# Altium schematic sheet PDB_schem.SchDoc
size D; SheetNumber: 1; SheetTotal: 1; SPICEModelCacheNIXBEUAC: <root> / <DocumentId>NIXBEUAC</DocumentId> / </root>
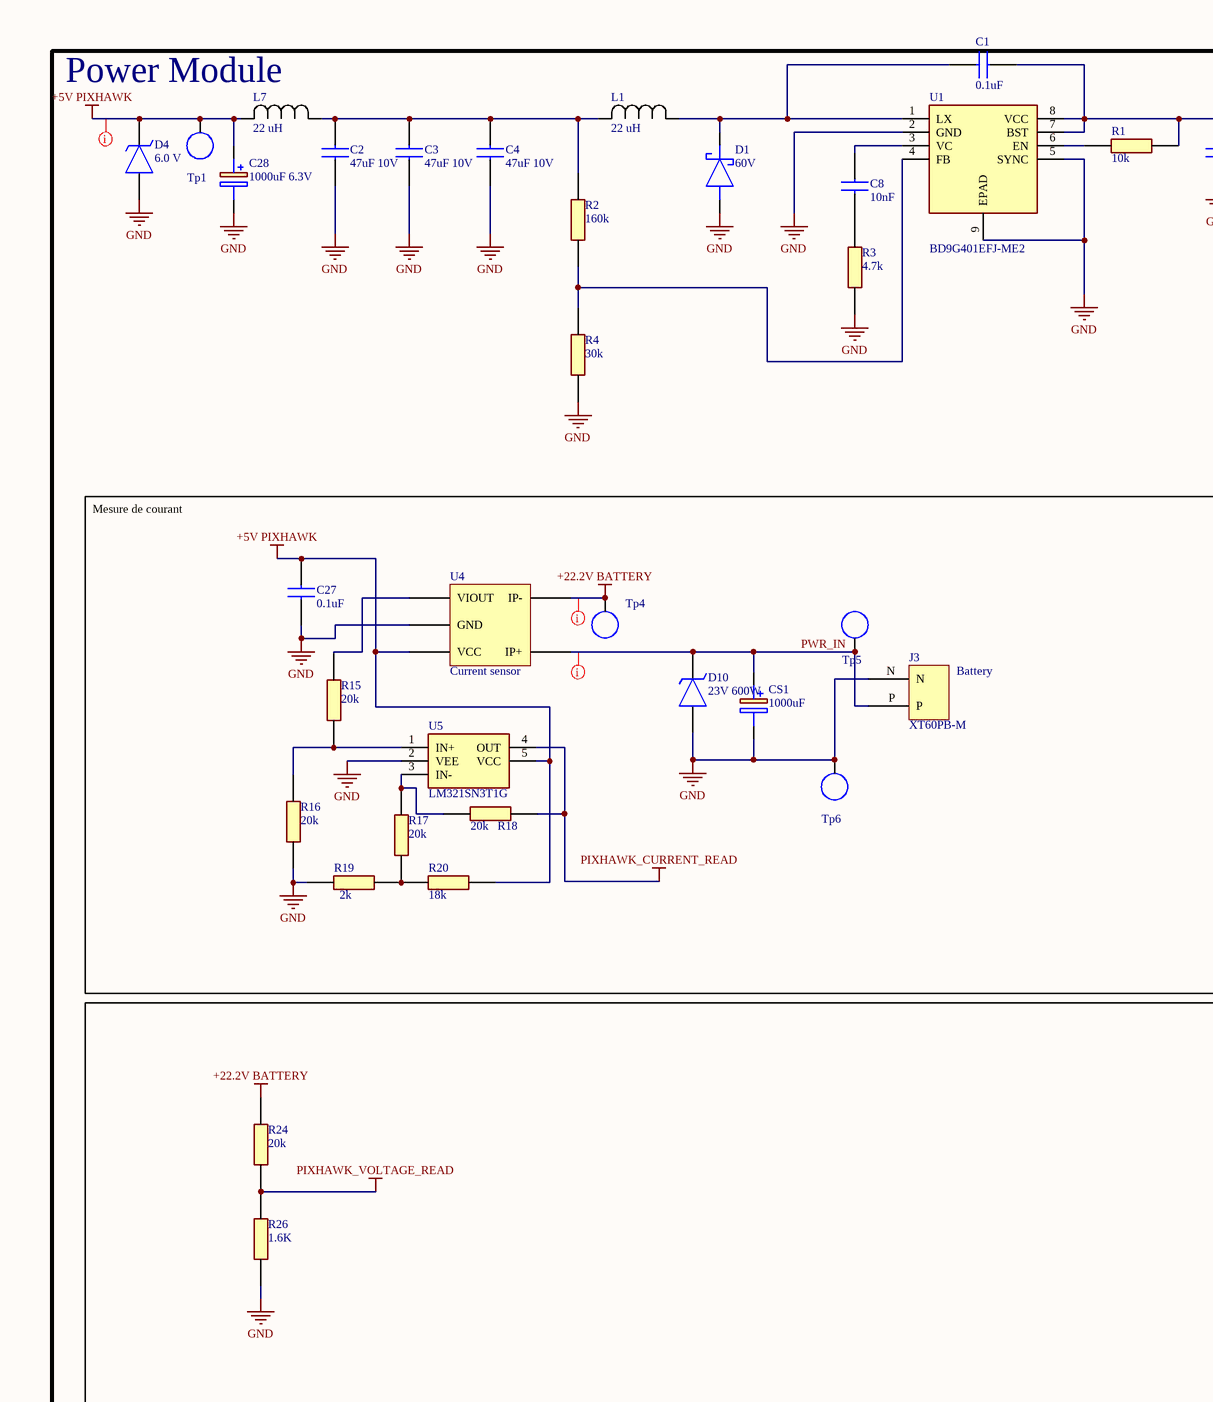
[diagram p0: PDB_schem.SchDoc, left]
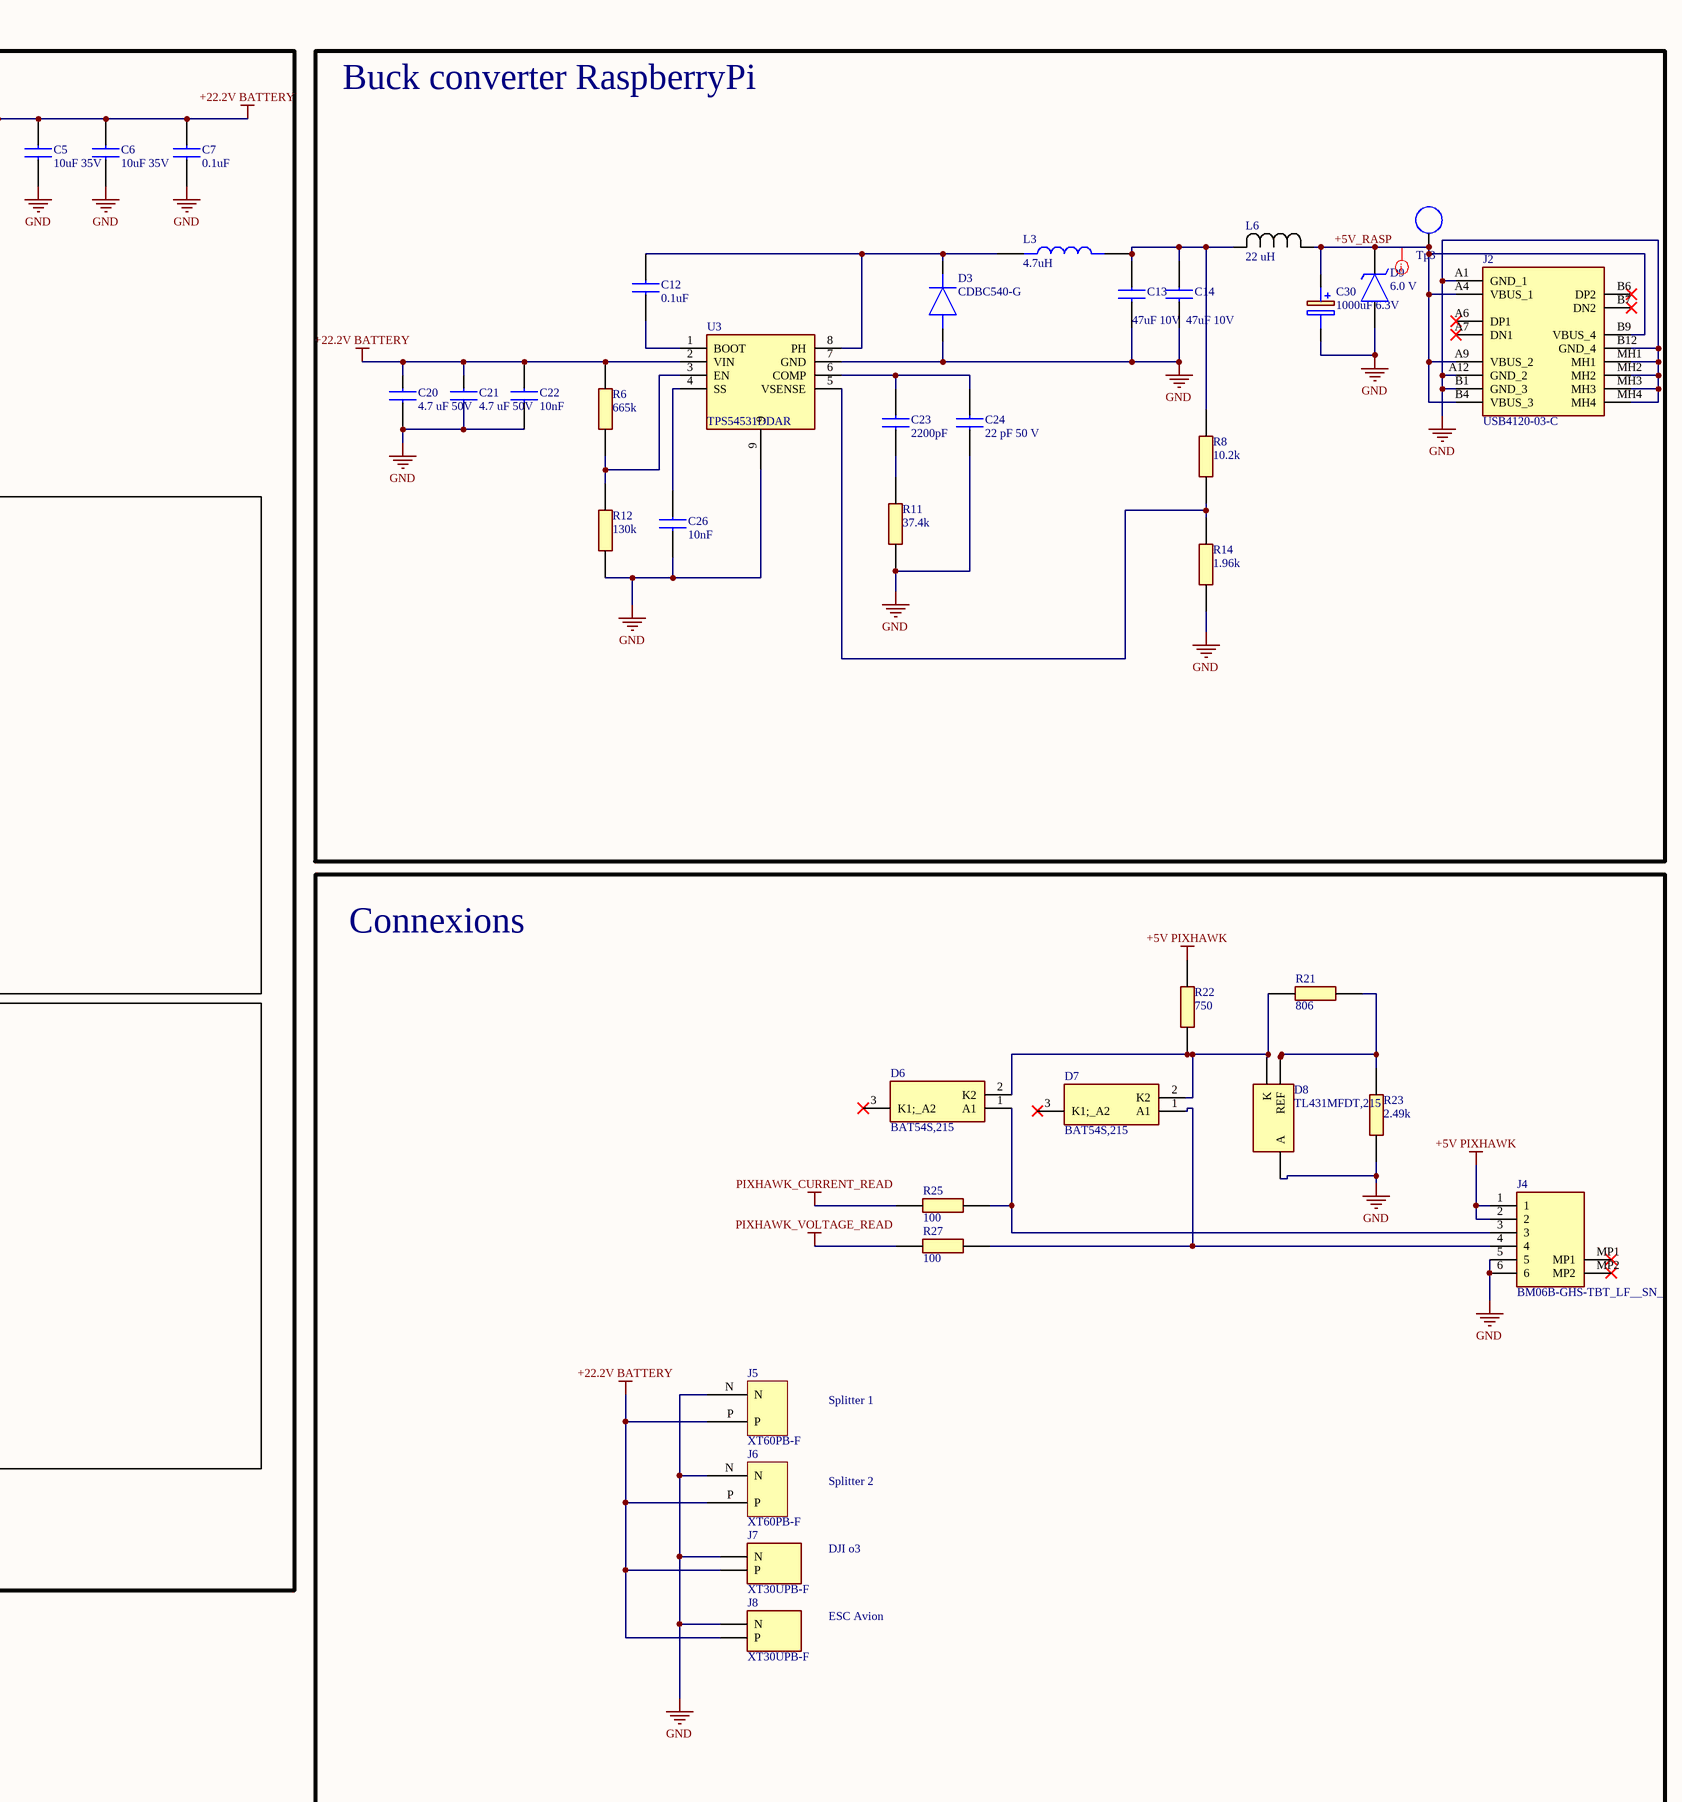
[diagram p1: PDB_schem.SchDoc, middle]
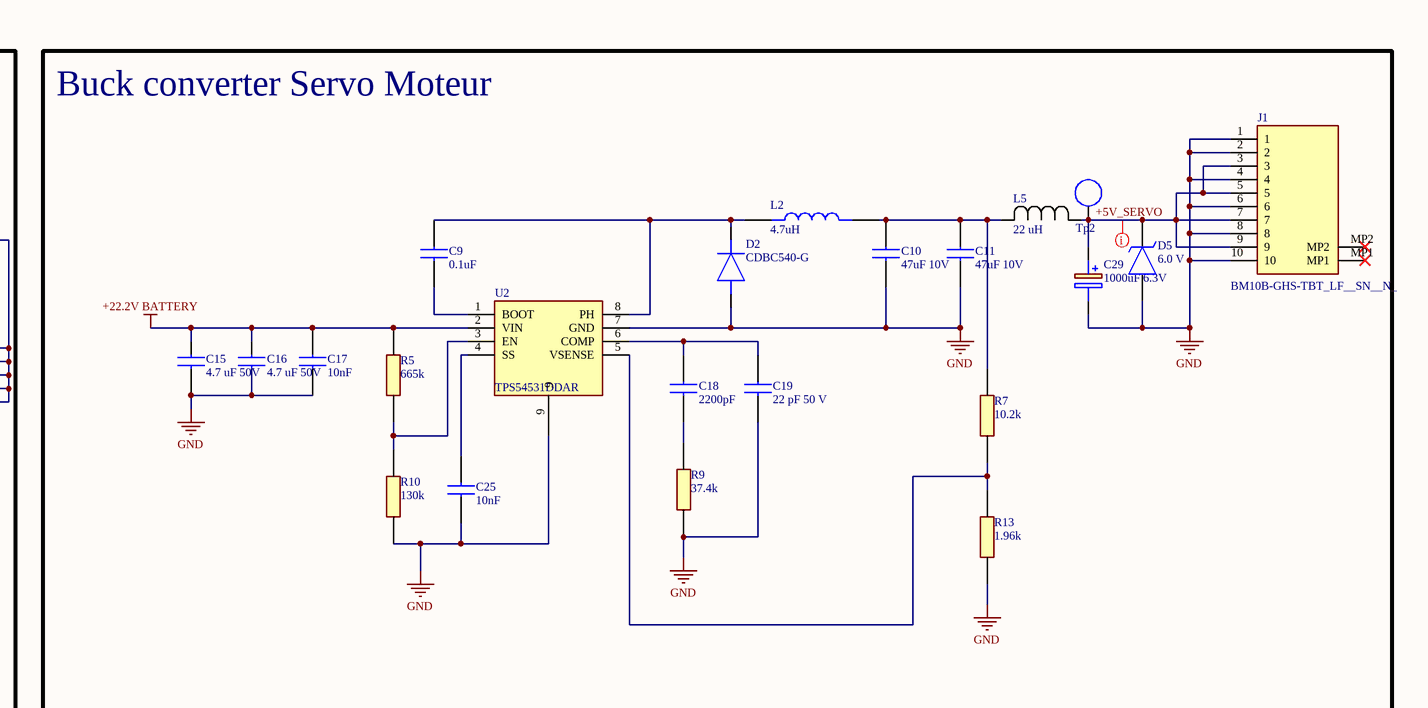
[diagram p2: PDB_schem.SchDoc, right]

## Parts
C1  0.1uF  [CAPC2012X145N]
C2  47uF 10V  [CAPC2012X145N]
C3  47uF 10V  [CAPC2012X145N]
C4  47uF 10V  [CAPC2012X145N]
C5  10uF 35V  [CAPC2012X145N]
C6  10uF 35V  [CAPC2012X145N]
C7  0.1uF  [CAPC2012X145N]
C8  10nF  [CAPC2012X145N]
C9  0.1uF  [CAPC2012X145N]
C10  47uF 10V  [CAPC2012X145N]
C11  47uF 10V  [CAPC2012X145N]
C12  0.1uF  [CAPC2012X145N]
C13  47uF 10V  [CAPC2012X145N]
C14  47uF 10V  [CAPC2012X145N]
C15  4.7 uF 50V  [CAPC2012X145N]
C16  4.7 uF 50V  [CAPC2012X145N]
C17  10nF  [CAPC2012X145N]
C18  2200pF  [CAPC3216X130N]
C19  22 pF 50 V  [CAPC2012X70N]
C20  4.7 uF 50V  [CAPC2012X145N]
C21  4.7 uF 50V  [CAPC2012X145N]
C22  10nF  [CAPC2012X145N]
C23  2200pF  [CAPC3216X130N]
C24  22 pF 50 V  [CAPC2012X70N]
C25  10nF  [CAPC2012X145N]
C26  10nF  [CAPC2012X145N]
C27  0.1uF  [CAPC2012X145N]
C28  1000uF 6.3V  [CAPAE830X1050N]
C29  1000uF 6.3V  [CAPAE830X1050N]
C30  1000uF 6.3V  [CAPAE830X1050N]
CS1  1000uF  [CAPPRD500W60D1025H2150]
D1  60V  [SODFL4725X105N]
D2  CDBC540-G  [DIOM8059X290N]
D3  CDBC540-G  [DIOM8059X290N]
D4  6.0 V  [SMBJ12A]
D5  6.0 V  [SMBJ12A]
D6  BAT54S,215  [SOT95P230X110-3N]
D7  BAT54S,215  [SOT95P230X110-3N]
D8  TL431MFDT,215  [SOT95P230X110-3N]
D9  6.0 V  [SMBJ12A]
D10  23V 600W  [SM6F22AY]
J1  BM10B-GHS-TBT_LF__SN__N_  [BM10BGHSTBTLFSNN]
J2  USB4120-03-C  [USB412003C]
J3  XT60PB-M  [XT60PB-M]
J4  BM06B-GHS-TBT_LF__SN_  [BM06BGHSTBTLFSN]
J5  XT60PB-F  [XT60PB-F]
J6  XT60PB-F  [XT60PB-F]
J7  XT30UPB-F  [XT30UPBF]
J8  XT30UPB-F  [XT30UPBF]
L1  22 uH  [IND_104CDMCCDS_SUM]
L2  4.7uH  [IND_ECS-MPIL0530-4R7MC]
L3  4.7uH  [IND_ECS-MPIL0530-4R7MC]
L5  22 uH  [IND_104CDMCCDS_SUM]
L6  22 uH  [IND_104CDMCCDS_SUM]
L7  22 uH  [IND_104CDMCCDS_SUM]
R1  10k  [RESC2012X60N]
R2  160k  [RESC2012X60N]
R3  4.7k  [RESC2012X60N]
R4  30k  [RESC2012X60N]
R5  665k  [RESC2012X50N]
R6  665k  [RESC2012X50N]
R7  10.2k  [RESC2012X50N]
R8  10.2k  [RESC2012X50N]
R9  37.4k  [RESC2012X50N]
R10  130k  [RESC2012X50N]
R11  37.4k  [RESC2012X50N]
R12  130k  [RESC2012X50N]
R13  1.96k  [RESC2012X50N]
R14  1.96k  [RESC2012X50N]
R15  20k  [RESC2012X50N]
R16  20k  [RESC2012X50N]
R17  20k  [RESC2012X50N]
R18  20k  [RESC2012X50N]
R19  2k  [RESC2012X60N]
R20  18k  [RESC2012X50N]
R21  806  [RESC2012X60N]
R22  750  [RESC2012X60N]
R23  2.49k  [RESC2012X50N]
R24  20k  [RESC2012X50N]
R25  100  [RESC2012X50N]
R26  1.6K  [RESC2012X60N]
R27  100  [RESC2012X50N]
Tp1  Testpoint  [Testpoint]  (value not drawn)  (no BOM)
Tp2  Testpoint  [Testpoint]  (value not drawn)  (no BOM)
Tp3  Testpoint  [Testpoint]  (value not drawn)  (no BOM)
Tp4  Testpoint  [Testpoint]  (value not drawn)  (no BOM)
Tp5  Testpoint  [Testpoint]  (value not drawn)  (no BOM)
Tp6  Testpoint  [Testpoint]  (value not drawn)  (no BOM)
U1  BD9G401EFJ-ME2  [SOIC127P600X100-9N]
U2  TPS54531DDAR  [SOIC127P600X175-8N]
U3  TPS54531DDAR  [SOIC127P600X175-8N]
U4  Current sensor  [ACS770xCB-PFF - Sans Via-in-Pad]
U5  LM321SN3T1G  [SOT95P275X110-5N]

## Blocks framed on the sheet
Power Module: C1-C8 C28 D1 D4 L1 L7 R1-R4 R24 R26 Tp1 U1
Buck converter RaspberryPi: C12-C14 C20-C24 C26 C30 D3 D9 J2 L3 L6 R6 R8 R11 R12 R14 Tp3 U3
Buck converter Servo Moteur: C9-C11 C15-C19 C25 C29 D2 D5 J1 L2 L5 R5 R7 R9 R10 R13 Tp2 U2
Battery: C27 CS1 D10 J3 R15-R20 Tp4-Tp6 U4 U5
Connexions: D6-D8 J4-J8 R21-R23 R25 R27

## Nets
+5V PIXHAWK: C27.2 C28.1(+) D4.1(K) J4.1 J4.2 L7.2 R20.2 R22.2 Tp1.TP U4.1(VCC) U5.5(VCC)
+22.2V BATTERY: C1.2 C5.2 C6.2 C7.2 C15.2 C16.2 C17.2 C20.2 C21.2 C22.2 J5.P J6.P J7.1(P) J8.1(P) R1.2 R5.2 R6.2 R24.1 Tp4.TP U1.7(BST) U1.8(VCC) U2.2(VIN) U3.2(VIN) U4.5(IP-)
GND: C2.1 C3.1 C4.1 C5.1 C6.1 C7.1 C10.1 C11.1 C13.1 C14.1 C15.1 C16.1 C17.1 C19.1 C20.1 C21.1 C22.1 C24.1 C25.1 C26.1 C27.1 C28.2(-) C29.2(-) C30.2(-) CS1.2(-) D1.2(A) D2.2(A) D3.2(A) D4.2(A) D5.2(A) D8.3(A) D9.2(A) D10.2(A) J1.1 J1.2 J1.4 J1.6 J1.8 J1.10 J2.A1(GND_1) J2.A12(GND_2) J2.B1(GND_3) J2.B12(GND_4) J2.MH1 J2.MH2 J2.MH3 J2.MH4 J3.N J4.5 J4.6 J5.N J6.N J7.2(N) J8.2(N) R3.1 R4.1 R9.1 R10.1 R11.1 R12.1 R13.1 R14.1 R16.1 R19.1 R23.1 R26.1 Tp6.TP U1.2(GND) U1.5(SYNC) U1.9(EPAD) U2.7(GND) U2.9 U3.7(GND) U3.9 U4.2(GND) U5.2(VEE)
PIXHAWK_CURRENT_READ: R18.1 R25.1 U5.4(OUT)
PIXHAWK_VOLTAGE_READ: R24.2 R26.2 R27.1
+5V_RASP: C30.1(+) D9.1(K) J2.A4(VBUS_1) J2.A9(VBUS_2) J2.B4(VBUS_3) J2.B9(VBUS_4) L6.1 Tp3.TP
+5V_SERVO: C29.1(+) D5.1(K) J1.3 J1.5 J1.7 J1.9 L5.1 Tp2.TP
PWR_IN: CS1.1(+) D10.1(K) J3.P Tp5.TP U4.4(IP+)
NetC1_1: C1.1 D1.1(K) L1.1 U1.1(LX)
NetC2_2: C2.2 C3.2 C4.2 L1.2 L7.1 R2.2
NetC8_1: C8.1 R3.2
NetC8_2: C8.2 U1.3(VC)
NetC9_1: C9.1 U2.1(BOOT)
NetC9_2: C9.2 D2.1(K) L2.1 U2.8(PH)
NetC10_2: C10.2 C11.2 L2.2 L5.2 R7.2
NetC12_1: C12.1 U3.1(BOOT)
NetC12_2: C12.2 D3.1(K) L3.1 U3.8(PH)
NetC13_2: C13.2 C14.2 L3.2 L6.2 R8.2
NetC18_1: C18.1 R9.2
NetC18_2: C18.2 C19.2 U2.6(COMP)
NetC23_1: C23.1 R11.2
NetC23_2: C23.2 C24.2 U3.6(COMP)
NetC25_2: C25.2 U2.4(SS)
NetC26_2: C26.2 U3.4(SS)
NetD6_1: D6.1(A1) J4.3 R25.2
NetD6_2: D6.2(K2) D7.2(K2) D8.2(K) R21.2 R22.1
NetD7_1: D7.1(A1) J4.4 R27.2
NetD8_1: D8.1(REF) R21.1 R23.2
NetR1_1: R1.1 U1.6(EN)
NetR2_1: R2.1 R4.2 U1.4(FB)
NetR5_1: R5.1 R10.2 U2.3(EN)
NetR6_1: R6.1 R12.2 U3.3(EN)
NetR7_1: R7.1 R13.2 U2.5(VSENSE)
NetR8_1: R8.1 R14.2 U3.5(VSENSE)
NetR15_1: R15.1 R16.2 U5.1(IN+)
NetR15_2: R15.2 U4.3(VIOUT)
NetR17_1: R17.1 R19.2 R20.1
NetR17_2: R17.2 R18.2 U5.3(IN-)

Not connected (* = marked no-connect by the designer): D6 3(K1;_A2)*; D7 3(K1;_A2)*; J1 MP1* MP2*; J2 A6(DP1)* A7(DN1)* B6(DP2)* B7(DN2)*; J4 MP1* MP2*

## Layout directives
rule Supply Nets [Voltage = 5.000]: +5V PIXHAWK, +5V_RASP, +5V_SERVO
rule Supply Nets [Voltage = 22.20]: +22.2V BATTERY, PWR_IN

## Notes on the sheet
- Mesure de courant
- Splitter 1
- Splitter 2
- DJI o3
- ESC Avion

## Library data of the parts
C1 C7 C9 C12 C27 = C2012X7R2A104K125AA: Capacitor; Manufacturer_Name: TDK; Datasheet Link: https://product.tdk.com/info/en/catalog/datasheets/mlcc_commercial_midvoltage_en.pdf; Height: 1.45mm; Manufacturer_Part_Number: C2012X7R2A104K125AA; Mouser Part Number: 810-C2012X7R2A104K; Mouser Price/Stock: https://www.mouser.co.uk/ProductDetail/TDK/C2012X7R2A104K125AA?qs=NRhsANhppD9J0ZsT2%2Fo%2F7Q%3D%3D; Arrow Part Number: C2012X7R2A104K125AA; Arrow Price/Stock: https://www.arrow.com/en/products/c2012x7r2a104k125aa/tdk?region=europe; ClassName: PowerModul
C2-C4 C10 C11 C13 C14 = C2012X5R1A476M125AC: Capacitor; Manufacturer_Name: TDK; Datasheet Link: https://product.tdk.com/info/en/catalog/datasheets/mlcc_commercial_midvoltage_en.pdf; Height: 1.45mm; Manufacturer_Part_Number: C2012X5R1A476M125AC; Mouser Part Number: 810-C2012X5R1A476M; Mouser Price/Stock: https://www.mouser.co.uk/ProductDetail/TDK/C2012X5R1A476M125AC?qs=LcTL%2F5vFEzGyFw5hxP%2FMXw%3D%3D; Arrow Part Number: C2012X5R1A476M125AC; Arrow Price/Stock: https://www.arrow.com/en/products/c2012x5r1a476m125ac/tdk?region=nac; ClassName: PowerModul
C5 C6 = C2012X5R1V106K125AC: Capacitor; Manufacturer_Name: TDK; Datasheet Link: https://product.tdk.com/info/en/catalog/datasheets/mlcc_commercial_midvoltage_en.pdf; Height: 1.45mm; Manufacturer_Part_Number: C2012X5R1V106K125AC; Mouser Part Number: 810-C2012X5R1V106K1C; Mouser Price/Stock: https://www.mouser.co.uk/ProductDetail/TDK/C2012X5R1V106K125AC?qs=6JAMGB%252BEdkwcwonKbQLeCg%3D%3D; Arrow Part Number: C2012X5R1V106K125AC; Arrow Price/Stock: https://www.arrow.com/en/products/c2012x5r1v106k125ac/tdk?region=europe; ClassName: PowerModul
C8 C17 C22 C25 C26 = C2012X7R2E103K125AA: Capacitor; Manufacturer_Name: TDK; Datasheet Link: https://product.tdk.com/info/en/catalog/datasheets/mlcc_commercial_midvoltage_en.pdf; Height: 1.45mm; Manufacturer_Part_Number: C2012X7R2E103K125AA; Mouser Part Number: 810-C2012X7R2E103K; Mouser Price/Stock: https://www.mouser.co.uk/ProductDetail/TDK/C2012X7R2E103K125AA?qs=NRhsANhppD%2FvPjIeAxskbg%3D%3D; Arrow Part Number: C2012X7R2E103K125AA; Arrow Price/Stock: https://www.arrow.com/en/products/c2012x7r2e103k125aa/tdk?region=nac; ClassName: PowerModul
C15 C16 C20 C21 = GRM21BR61H475KE51L: Capacitor; Manufacturer_Name: Murata Electronics; Datasheet Link: https://search.murata.co.jp/Ceramy/image/img/A01X/G101/ENG/GRM21BR61H475KE51-01A.pdf; Height: 1.45mm; Manufacturer_Part_Number: GRM21BR61H475KE51L; Mouser Part Number: 81-GRM21BR61H475KE1L; Mouser Price/Stock: https://www.mouser.co.uk/ProductDetail/Murata-Electronics/GRM21BR61H475KE51L?qs=eeBpzGFlv%252B%252BOtLzDC1PY6Q%3D%3D; Arrow Part Number: GRM21BR61H475KE51L; Arrow Price/Stock: https://www.arrow.com/en/products/grm21br61h475ke51l/murata-manufacturing?region=nac
C18 C23 = CGA5H4C0G2J222J115AA: Capacitor 2200pF 630V; Manufacturer_Name: TDK; Datasheet Link: http://docs-europe.electrocomponents.com/webdocs/14e9/0900766b814e9125.pdf; Height: 1.3mm; Manufacturer_Part_Number: CGA5H4C0G2J222J115AA
C19 C24 = CC0805JRNPO9BN220: Capacitor; Manufacturer_Name: YAGEO; Datasheet Link: https://componentsearchengine.com/Datasheets/2/CC0805JRNPO9BN220.pdf; Height: 0.7mm; Manufacturer_Part_Number: CC0805JRNPO9BN220; Mouser Part Number: 603-CC805JRNPO9BN220; Mouser Price/Stock: https://www.mouser.co.uk/ProductDetail/YAGEO/CC0805JRNPO9BN220?qs=vTakOoo5QyK71b5vkghGmg%3D%3D
C28-C30 = UCD0J102MNL1GS: Capacitor Polarised; Manufacturer_Name: Nichicon; Datasheet Link: https://www.nichicon.co.jp/english/products/pdfs/e-ucd.pdf; Height: 10.5mm; Manufacturer_Part_Number: UCD0J102MNL1GS; Mouser Part Number: 647-UCD0J102MNL1GS; Mouser Price/Stock: https://www.mouser.co.uk/ProductDetail/Nichicon/UCD0J102MNL1GS?qs=c0uEScvPYN2yS0opD8R0vQ%3D%3D; Arrow Part Number: UCD0J102MNL1GS; Arrow Price/Stock: https://www.arrow.com/en/products/ucd0j102mnl1gs/nichicon
CS1 = 35PX1000MEFC10X20: Capacitor Polarised; Manufacturer_Name: Rubycon; Datasheet Link: https://www.rubycon.co.jp/wp-content/uploads/catalog-aluminum/PX.pdf; Height: 21.5mm; Manufacturer_Part_Number: 35PX1000MEFC10X20; Mouser Part Number: 232-35PX1000MEFC10X2; Mouser Price/Stock: https://www.mouser.co.uk/ProductDetail/Rubycon/35PX1000MEFC10X20?qs=T3oQrply3y86%2F1qnNfO%252BAA%3D%3D; Arrow Part Number: 35PX1000MEFC10X20; Arrow Price/Stock: https://www.arrow.com/en/products/35px1000mefc10x20/rubycon?region=nac
D1 = RBR5LAM60ATFTR: Schottky Diode; Manufacturer_Name: ROHM Semiconductor; Datasheet Link: https://fscdn.rohm.com/en/products/databook/datasheet/discrete/diode/schottky_barrier/rbr5lam60atftr-e.pdf; Height: 1.05mm; Manufacturer_Part_Number: RBR5LAM60ATFTR; Mouser Part Number: 755-RBR5LAM60ATFTR; Mouser Price/Stock: https://www.mouser.co.uk/ProductDetail/ROHM-Semiconductor/RBR5LAM60ATFTR?qs=4v%252BiZTmLVHGKJkO8tMW4zA%3D%3D; ClassName: PowerModul
D2 D3 = CDBC540-G: Diode; Manufacturer_Name: Comchip Technology; Datasheet Link: https://eu.mouser.com/datasheet/2/80/CDBC520-HF_Thru195340._CDBC5100-HF_RevB-1480991.pdf; Height: 2.9mm; Manufacturer_Part_Number: CDBC540-G; Mouser Part Number: 750-CDBC540-G; Mouser Price/Stock: https://www.mouser.co.uk/ProductDetail/Comchip-Technology/CDBC540-G?qs=tw%252BuQ%2FB6PO2ExpPYY64Vzw%3D%3D; Arrow Part Number: CDBC540-G; Arrow Price/Stock: https://www.arrow.com/en/products/cdbc540-g/comchip-technology?utm_currency=USD&region=nac
D4 D5 D9 = SMBJ6.0A: TVS Diode (Uni-directional); Manufacturer_Name: STMicroelectronics; Datasheet Link: https://www.st.com/resource/en/datasheet/smbj12a.pdf; Height: 2.45mm; Manufacturer_Part_Number: SMBJ6.0A
D6 D7 = BAT54S,215: Schottky Diode; Manufacturer_Name: Nexperia; Datasheet Link: https://assets.nexperia.com/documents/data-sheet/BAT54S.pdf; Height: 1.1mm; Manufacturer_Part_Number: BAT54S,215; Mouser Part Number: 771-BAT54S-T/R; Mouser Price/Stock: https://www.mouser.co.uk/ProductDetail/Nexperia/BAT54S215?qs=me8TqzrmIYVOaf3j7zH0Wg%3D%3D; Arrow Part Number: BAT54S,215; Arrow Price/Stock: https://www.arrow.com/en/products/bat54s215/nexperia?utm_currency=USD&region=europe
D8 = TL431MFDT,215: Integrated Circuit; Manufacturer_Name: Nexperia; Datasheet Link: https://assets.nexperia.com/documents/data-sheet/TL431_FAM.pdf; Height: 1.1mm; Manufacturer_Part_Number: TL431MFDT,215; Mouser Part Number: 771-TL431MFDT215; Mouser Price/Stock: https://www.mouser.co.uk/ProductDetail/Nexperia/TL431MFDT215?qs=A1cBxND5mHKvFzVl3lBdcQ%3D%3D; Arrow Part Number: TL431MFDT,215; Arrow Price/Stock: https://www.arrow.com/en/products/tl431mfdt215/nexperia?utm_currency=USD&region=nac
D10 = SM6F23AY: TVS Diode (Uni-directional); Manufacturer_Name: STMicroelectronics; Datasheet Link: https://www.st.com/resource/en/datasheet/sm6f10ay.pdf; Height: 1.03mm; Manufacturer_Part_Number: SM6F23AY; Mouser Part Number: 511-SM6F23AY; Mouser Price/Stock: https://www.mouser.co.uk/ProductDetail/STMicroelectronics/SM6F23AY?qs=BJlw7L4Cy79cZKdhit2Bog%3D%3D
J1 = BM10B-GHS-TBT_LF__SN__N_: Connector; Manufacturer_Name: JST (JAPAN SOLDERLESS TERMINALS); Manufacturer_Part_Number: BM10B-GHS-TBT(LF)(SN)(N); Datasheet Link: http://www.jst-mfg.com/product/pdf/eng/eGH.pdf; Height: 4.05mm; Arrow Part Number: BM10B-GHS-TBT(LF)(SN)(N); Arrow Price/Stock: https://www.arrow.com/en/products/bm10b-ghs-tbt-lf-sn-n/jst-manufacturing?utm_currency=USD&region=europe
J2 = USB4120-03-C: Connector; Manufacturer_Name: GCT (GLOBAL CONNECTOR TECHNOLOGY); Datasheet Link: https://gct.co/connector/usb4120; Height: 6.75mm; Manufacturer_Part_Number: USB4120-03-C; Mouser Part Number: 640-USB4120-03-C; Mouser Price/Stock: https://www.mouser.co.uk/ProductDetail/GCT/USB4120-03-C?qs=KUoIvG%2F9IlZaAd13sVDhkQ%3D%3D
J3 = XT60PB-M: Connector; ComponentLink1Description: Datasheet; ComponentLink1URL: https://www.tme.com/Document/ceb306d6300f4d2860483975b79af125/XT60UPB-M.pdf
J4 = BM06B-GHS-TBT_LF__SN_: Connector; Manufacturer_Name: JST (JAPAN SOLDERLESS TERMINALS); Manufacturer_Part_Number: BM06B-GHS-TBT(LF)(SN); Datasheet Link: https://datasheet.lcsc.com/szlcsc/2004111131_JST-Sales-America-BM06B-GHS-TBT-LF-SN_C495534.pdf; Height: 4.05mm; Mouser Part Number: 306-BM06BGHSTBTLFSNN; Mouser Price/Stock: https://www.mouser.co.uk/ProductDetail/JST-Commercial/BM06B-GHS-TBTLFSN?qs=cdbOS8ANM9CObKjnhD04mw%3D%3D
J5 J6 = XT60PB-F: Connector; ComponentLink1Description: Datasheet; ComponentLink1URL: https://www.tme.com/Document/aa7a0328674fda4109d00dc748bb5162/XT60UPB-F.pdf
J7 J8 = XT30UPB-F: Connector; Manufacturer_Name: Amass; Datasheet Link: https://www.tme.eu/Document/81f11ca924696756331f21b972812074/XT30PB-F.pdf; Height: 9.4mm; Manufacturer_Part_Number: XT30UPB-F
L1 L5-L7 = 104CDMCCDS-220MC: Bobine de 22 uH, 5 A; Manufacturer_Name: Sumida; Type: Fixed Inductors; Copyright: Copyright (C) 2025 Ultra Librarian. All rights reserved.; Manufacturer_Part_Number: 104CDMCCDS-220MC; ComponentLink1Description: Datasheet; ComponentLink1URL: https://products.sumida.com/products/pdf/104CDMCCDS.pdf
L2 L3 = ECS-MPIL0530-4R7MC: 4.7 µH Shielded Molded Inductor 5 A 60mOhm Max Nonstandard -; MF: ECS Inc.; SnapEDA_Link: https://www.snapeda.com/parts/ECS-MPIL0530-4R7MC/ECS/view-part/?ref=snap; Package: ECS-MPIL0530-0-2 ECS; Value: *; MP: ECS-MPIL0530-4R7MC; Check_prices: https://www.snapeda.com/parts/ECS-MPIL0530-4R7MC/ECS/view-part/?ref=eda
R1 = CRCW080510K0FKEAHP: Resistor; Manufacturer_Name: Vishay; Datasheet Link: https://componentsearchengine.com/Datasheets/1/CRCW08051R00FKEAHP.pdf; Height: 0.6mm; Manufacturer_Part_Number: CRCW080510K0FKEAHP; Mouser Part Number: 71-CRCW080510K0FKEAH; Mouser Price/Stock: https://www.mouser.co.uk/ProductDetail/Vishay-Dale/CRCW080510K0FKEAHP?qs=FlFvgi4rxBybVOW6oiRQjA%3D%3D; Arrow Part Number: CRCW080510K0FKEAHP; Arrow Price/Stock: https://www.arrow.com/en/products/crcw080510k0fkeahp/vishay?utm_currency=USD&region=europe; ClassName: PowerModul
R2 = CRCW0805160KFKEAHP: Resistor; Manufacturer_Name: Vishay; Datasheet Link: https://componentsearchengine.com/Datasheets/1/CRCW08051R00FKEAHP.pdf; Height: 0.6mm; Manufacturer_Part_Number: CRCW0805160KFKEAHP; ClassName: PowerModul
R3 = CRCW08054K70FKEAC: Resistor; Manufacturer_Name: Vishay; Datasheet Link: https://mouser.componentsearchengine.com/Datasheets/1/CRCW08054K70FKEAC.pdf; Height: 0.6mm; Manufacturer_Part_Number: CRCW08054K70FKEAC; Mouser Part Number: 71-CRCW08054K70FKEAC; Mouser Price/Stock: https://www.mouser.co.uk/ProductDetail/Vishay-Dale/CRCW08054K70FKEAC?qs=E3Y5ESvWgWOQAAVugewEHA%3D%3D; Arrow Part Number: CRCW08054K70FKEAC; Arrow Price/Stock: https://www.arrow.com/en/products/crcw08054k70fkeac/vishay?region=nac; ClassName: PowerModul
R4 = CRCW080530K0FKEAC: Resistor; Manufacturer_Name: Vishay; Datasheet Link: https://mouser.componentsearchengine.com/Datasheets/1/CRCW080530K0FKEAC.pdf; Height: 0.6mm; Manufacturer_Part_Number: CRCW080530K0FKEAC; Mouser Part Number: 71-CRCW080530K0FKEAC; Mouser Price/Stock: https://www.mouser.co.uk/ProductDetail/Vishay-Dale/CRCW080530K0FKEAC?qs=E3Y5ESvWgWMYq9MgiyaMow%3D%3D; Arrow Part Number: CRCW080530K0FKEAC; Arrow Price/Stock: https://www.arrow.com/en/products/crcw080530k0fkeac/vishay?region=nac; ClassName: PowerModul
R5 R6 = CRCW0805665KFKEA: Resistor; Manufacturer_Name: Vishay; Datasheet Link: http://www.vishay.com/docs/20035/dcrcwe3.pdf; Height: 0.5mm; Manufacturer_Part_Number: CRCW0805665KFKEA
R7 R8 = CRCW080510K2FKEA: Resistor; Manufacturer_Name: Vishay; Datasheet Link: http://www.vishay.com/docs/20035/dcrcwe3.pdf; Height: 0.5mm; Manufacturer_Part_Number: CRCW080510K2FKEA; Mouser Part Number: 71-CRCW0805-10.2K-E3; Mouser Price/Stock: https://www.mouser.co.uk/ProductDetail/Vishay-Dale/CRCW080510K2FKEA?qs=LOX6nxTstibTXRK16X5NEQ%3D%3D; Arrow Part Number: CRCW080510K2FKEA; Arrow Price/Stock: https://www.arrow.com/en/products/crcw080510k2fkea/vishay?region=nac
R9 R11 = CRCW080537K4FKEA: Resistor; Manufacturer_Name: Vishay; Datasheet Link: http://www.vishay.com/docs/20035/dcrcwe3.pdf; Height: 0.5mm; Manufacturer_Part_Number: CRCW080537K4FKEA; Mouser Part Number: 71-CRCW0805-37.4K-E3; Mouser Price/Stock: https://www.mouser.co.uk/ProductDetail/Vishay-Dale/CRCW080537K4FKEA?qs=ofC1ORbyWJfwcxfoRR0MKw%3D%3D
R10 R12 = CRCW0805130KFKEA: Resistor; Manufacturer_Name: Vishay; Datasheet Link: http://www.vishay.com/docs/20035/dcrcwe3.pdf; Height: 0.5mm; Manufacturer_Part_Number: CRCW0805130KFKEA; Mouser Part Number: 71-CRCW0805-130K-E3; Mouser Price/Stock: https://www.mouser.co.uk/ProductDetail/Vishay-Dale/CRCW0805130KFKEA?qs=0y7Riw94L4iHKWUxGOctIA%3D%3D; Arrow Part Number: CRCW0805130KFKEA; Arrow Price/Stock: https://www.arrow.com/en/products/crcw0805130kfkea/vishay
R13 R14 = CRCW08051K96FKEA: Resistor; Manufacturer_Name: Vishay; Datasheet Link: http://www.vishay.com/docs/20035/dcrcwe3.pdf; Height: 0.5mm; Manufacturer_Part_Number: CRCW08051K96FKEA; Mouser Part Number: 71-CRCW08051K96FKEA; Mouser Price/Stock: https://www.mouser.co.uk/ProductDetail/Vishay-Dale/CRCW08051K96FKEA?qs=1CkV0QOCgMpA%2F6GTgXIN%2Fg%3D%3D; Arrow Part Number: CRCW08051K96FKEA; Arrow Price/Stock: https://www.arrow.com/en/products/crcw08051k96fkea/vishay?region=nac
R15-R18 R24 = CRCW080520K0FKEA: Resistor; Manufacturer_Name: Vishay; Datasheet Link: http://www.vishay.com/docs/20035/dcrcwe3.pdf; Height: 0.5mm; Manufacturer_Part_Number: CRCW080520K0FKEA; Mouser Part Number: 71-CRCW0805-20K-E3; Mouser Price/Stock: https://www.mouser.co.uk/ProductDetail/Vishay-Dale/CRCW080520K0FKEA?qs=t6Mf8e9K%2Ful9pWSqXxFD1w%3D%3D; Arrow Part Number: CRCW080520K0FKEA; Arrow Price/Stock: https://www.arrow.com/en/products/crcw080520k0fkea/vishay
R19 = CRCW08052K00FKEAC: Resistor; Manufacturer_Name: Vishay; Datasheet Link: http://www.vishay.com/docs/28773/crcwce3.pdf; Height: 0.6mm; Manufacturer_Part_Number: CRCW08052K00FKEAC; Mouser Part Number: 71-CRCW08052K00FKEAC; Mouser Price/Stock: https://www.mouser.co.uk/ProductDetail/Vishay-Dale/CRCW08052K00FKEAC?qs=E3Y5ESvWgWP6floxGsbShA%3D%3D; Arrow Part Number: CRCW08052K00FKEAC; Arrow Price/Stock: https://www.arrow.com/en/products/crcw08052k00fkeac/vishay?utm_currency=USD&region=nac
R20 = CRCW080518K0FKEAC: Resistor; Manufacturer_Name: Vishay; Datasheet Link: https://www.arrow.com/en/products/crcw080518k0fkeac/vishay?region=nac; Height: 0.5mm; Manufacturer_Part_Number: CRCW080518K0FKEAC; Mouser Part Number: 71-CRCW080518K0FKEAC; Mouser Price/Stock: https://www.mouser.co.uk/ProductDetail/Vishay-Dale/CRCW080518K0FKEAC?qs=E3Y5ESvWgWPSwNx6fNHotQ%3D%3D; Arrow Part Number: CRCW080518K0FKEAC; Arrow Price/Stock: https://www.arrow.com/en/products/crcw080518k0fkeac/vishay?region=nac
R21 = CRCW0805806RFKEAHP: Resistor; Manufacturer_Name: Vishay; Datasheet Link: https://componentsearchengine.com/Datasheets/1/CRCW08051R00FKEAHP.pdf; Height: 0.6mm; Manufacturer_Part_Number: CRCW0805806RFKEAHP
R22 = CRCW0805750RFKEAHP: Resistor; Manufacturer_Name: Vishay; Datasheet Link: https://componentsearchengine.com/Datasheets/1/CRCW08051R00FKEAHP.pdf; Height: 0.6mm; Manufacturer_Part_Number: CRCW0805750RFKEAHP; Mouser Part Number: 71-CRCW0805750RFKEAH; Mouser Price/Stock: https://www.mouser.co.uk/ProductDetail/Vishay-Dale/CRCW0805750RFKEAHP?qs=40TFAHZMFvdp5ouInDDfaw%3D%3D; Arrow Part Number: CRCW0805750RFKEAHP; Arrow Price/Stock: https://www.arrow.com/en/products/crcw0805750rfkeahp/vishay?region=nac
R23 = CRCW08052K49FKEAC: Resistor; Manufacturer_Name: Vishay; Datasheet Link: https://componentsearchengine.com/Datasheets/1/CRCW08052K49FKEAC.pdf; Height: 0.5mm; Manufacturer_Part_Number: CRCW08052K49FKEAC; Mouser Part Number: 71-CRCW08052K49FKEAC; Mouser Price/Stock: https://www.mouser.com/Search/Refine.aspx?Keyword=71-CRCW08052K49FKEAC; Arrow Part Number: CRCW08052K49FKEAC; Arrow Price/Stock: https://www.arrow.com/en/products/crcw08052k49fkeac/vishay
R25 R27 = CRCW0805100RFKEA: Resistor; Manufacturer_Name: Vishay; Datasheet Link: http://www.vishay.com/docs/20035/dcrcwe3.pdf; Height: 0.5mm; Manufacturer_Part_Number: CRCW0805100RFKEA; Mouser Part Number: 71-CRCW0805-100-E3; Mouser Price/Stock: https://www.mouser.co.uk/ProductDetail/Vishay-Dale/CRCW0805100RFKEA?qs=LOX6nxTstiYDPDKmuLyNLw%3D%3D; Arrow Part Number: CRCW0805100RFKEA; Arrow Price/Stock: https://www.arrow.com/en/products/crcw0805100rfkea/vishay?utm_currency=USD&region=nac
R26 = CRCW08051K60FKEAC: Resistor; Manufacturer_Name: Vishay; Datasheet Link: https://www.arrow.com/en/products/crcw08051k60fkeac/vishay; Height: 0.6mm; Manufacturer_Part_Number: CRCW08051K60FKEAC; Mouser Part Number: 71-CRCW08051K60FKEAC; Mouser Price/Stock: https://www.mouser.co.uk/ProductDetail/Vishay-Dale/CRCW08051K60FKEAC?qs=E3Y5ESvWgWMJaZYHQus8LQ%3D%3D; Arrow Part Number: CRCW08051K60FKEAC; Arrow Price/Stock: https://www.arrow.com/en/products/crcw08051k60fkeac/vishay
U1 = BD9G401EFJ-ME2: Buck converter; Manufacturer_Name: ROHM Semiconductor; Datasheet Link: https://componentsearchengine.com/Datasheets/1/BD9G401EFJ-ME2.pdf; Height: 1mm; Manufacturer_Part_Number: BD9G401EFJ-ME2; Mouser Part Number: 755-BD9G401EFJ-ME2; Mouser Price/Stock: https://www.mouser.co.uk/ProductDetail/ROHM-Semiconductor/BD9G401EFJ-ME2?qs=HXFqYaX1Q2yXryPBxafgDg%3D%3D; ClassName: PowerModul
U2 U3 = TPS54531DDAR: Power Supply; Manufacturer_Name: Texas Instruments; Datasheet Link: http://www.ti.com/lit/gpn/tps54531; Height: 1.7mm; Manufacturer_Part_Number: TPS54531DDAR; Mouser Part Number: 595-TPS54531DDAR; Mouser Price/Stock: https://www.mouser.co.uk/ProductDetail/Texas-Instruments/TPS54531DDAR?qs=jA5Ki6243onykODzUePbag%3D%3D; Arrow Part Number: TPS54531DDAR; Arrow Price/Stock: https://www.arrow.com/en/products/tps54531ddar/texas-instruments?utm_currency=USD&region=nac
U4 = ACS770KCB-150U-PFF-T: 150 A , Unidirectional; ComponentLink1Description: Datasheet; ComponentLink1URL: https://www.allegromicro.com/~/media/Files/Datasheets/ACS770-Datasheet.ashx
U5 = LM321SN3T1G: Integrated Circuit; Manufacturer_Name: onsemi; Datasheet Link: https://www.onsemi.com/pub/Collateral/LM321-D.PDF; Height: 1.1mm; Manufacturer_Part_Number: LM321SN3T1G; Mouser Part Number: 863-LM321SN3T1G; Mouser Price/Stock: https://www.mouser.co.uk/ProductDetail/onsemi/LM321SN3T1G?qs=slMPpRTKD5qNVsCzBsHVZA%3D%3D; Arrow Part Number: LM321SN3T1G; Arrow Price/Stock: https://www.arrow.com/en/products/lm321sn3t1g/on-semiconductor?utm_currency=USD&region=nac